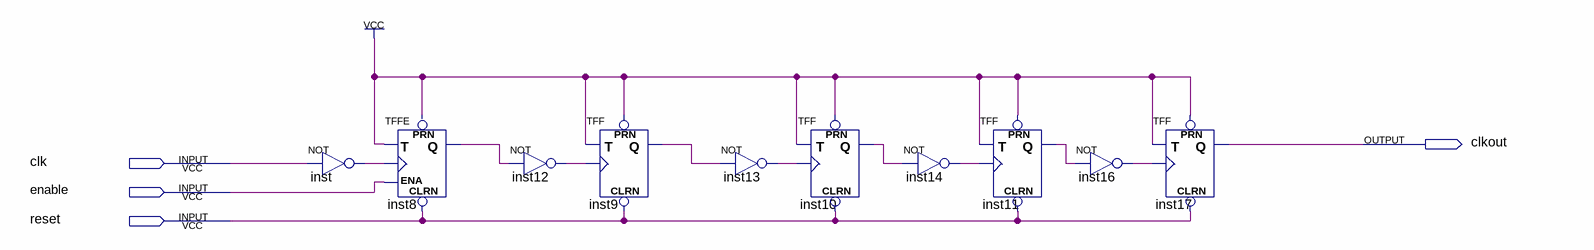
[diagram p0: schematic sheet]
// Quartus schematic divider.bdf as structural Verilog: 10 symbols, 4 pins
module divider (
  input  clk,
  input  enable,
  input  reset,
  output clkout
);

  wire inst8_q, inst9_q, inst10_q, inst11_q, inst12_out, inst13_out, inst14_out, inst16_out, inst_out;

  not inst (inst_out, clk);
  TFFE inst8 (.CLRN(reset), .T(1'b1), .CLK(inst_out), .ENA(enable), .PRN(1'b1), .Q(inst8_q));
  not inst12 (inst12_out, inst8_q);
  TFF inst9 (.PRN(1'b1), .CLRN(reset), .T(1'b1), .CLK(inst12_out), .Q(inst9_q));
  not inst13 (inst13_out, inst9_q);
  TFF inst10 (.PRN(1'b1), .CLRN(reset), .T(1'b1), .CLK(inst13_out), .Q(inst10_q));
  not inst14 (inst14_out, inst10_q);
  TFF inst11 (.PRN(1'b1), .CLRN(reset), .T(1'b1), .CLK(inst14_out), .Q(inst11_q));
  not inst16 (inst16_out, inst11_q);
  TFF inst17 (.PRN(1'b1), .CLRN(reset), .T(1'b1), .CLK(inst16_out), .Q(clkout));
endmodule
